# Altium schematic sheet MCU_ESP32.SchDoc: Projet M1 2024
size A4; DrawnBy: Group 04; DocumentNumber: 1; Revision: V1.0 Rev A; SheetNumber: 6; SheetTotal: 6
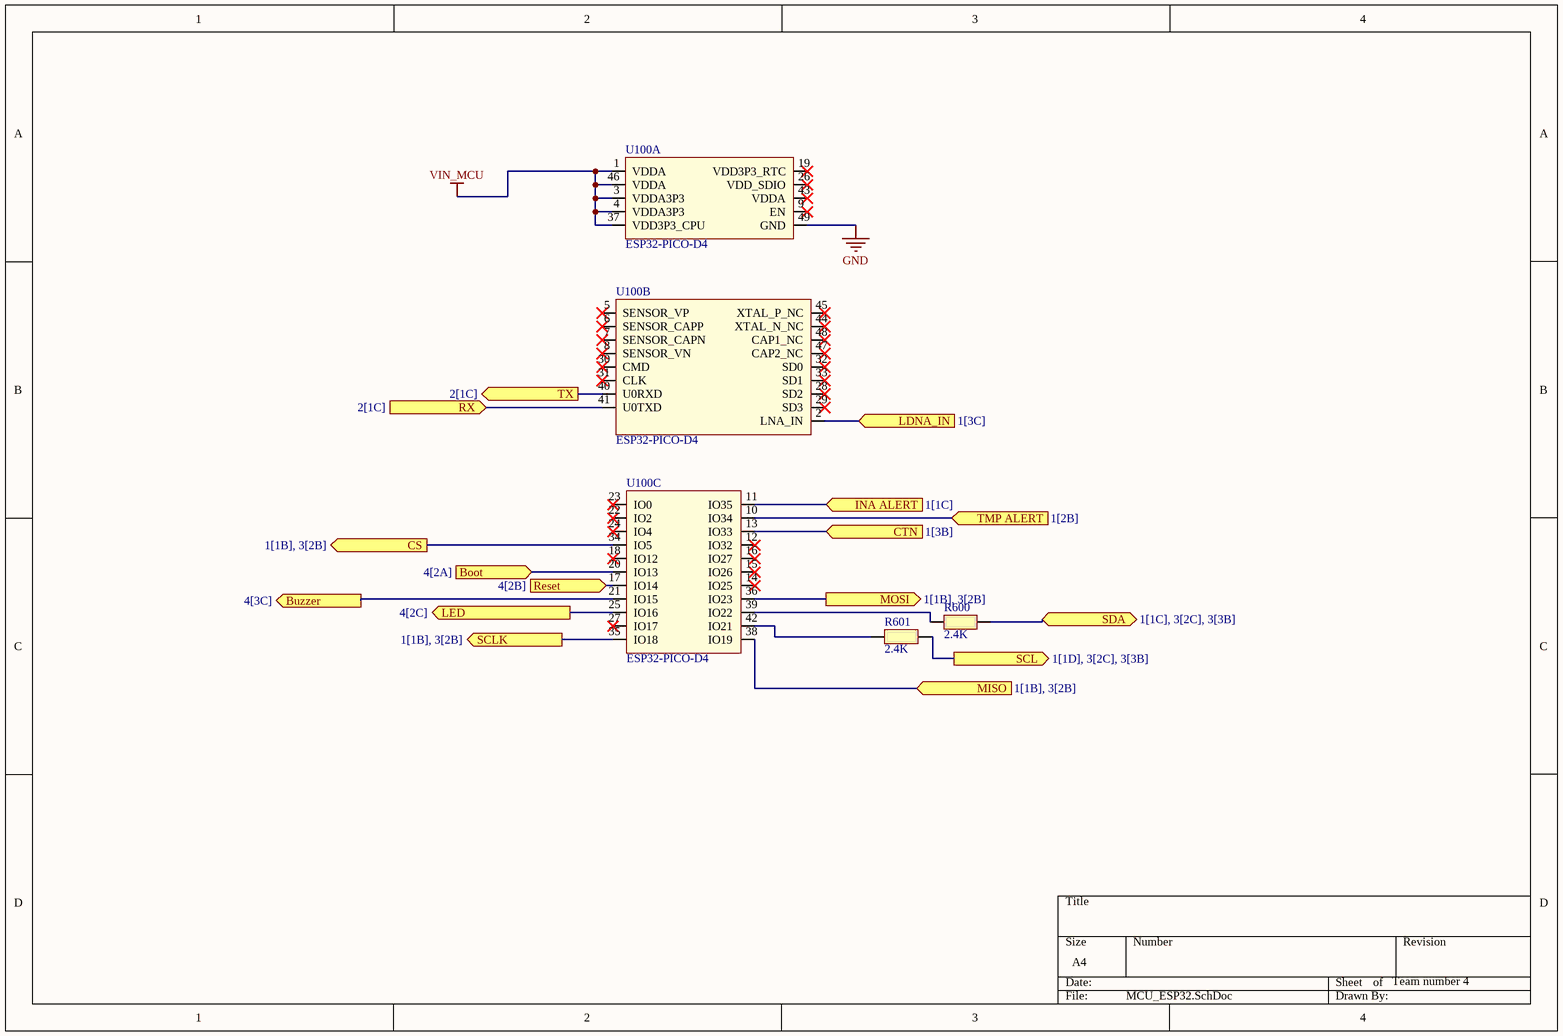
[diagram p0: MCU_ESP32.SchDoc]

## Parts
R600  2.4K  [RESC1005X06N]
R601  2.4K  [RESC1005X06N]
U100  ESP32-PICO-D4  [PQFN50P700X700X104_HS-49N]  (parts A,B,C of 3)

## Ports
Boot (in, see 4[2A]), Buzzer (out, see 4[3C]), CS (out, see 1[1B], 3[2B]), CTN (in, see 1[3B]), INA ALERT (in, see 1[1C]), LDNA_IN (in, see 1[3C]), LED (out, see 4[2C]), MISO (in, see 1[1B], 3[2B]), MOSI (out, see 1[1B], 3[2B]), Reset (in, see 4[2B]), RX (in, see 2[1C]), SCL (out, see 1[1D], 3[2C], 3[3B]), SCLK (out, see 1[1B], 3[2B]), SDA (bidir, see 1[1C], 3[2C], 3[3B]), TMP ALERT (in, see 1[2B]), TX (out, see 2[1C])

## Nets
GND: U100.49(GND)
VIN_MCU: U100.1(VDDA) U100.3(VDDA3P3) U100.4(VDDA3P3) U100.37(VDD3P3_CPU) U100.46(VDDA)
Boot: U100.20(IO13) ; port Boot
Buzzer: U100.21(IO15) ; port Buzzer
CS: U100.34(IO5) ; port CS
CTN: U100.13(IO33) ; port CTN
INA ALERT: U100.11(IO35) ; port INA ALERT
LDNA_IN: U100.2(LNA_IN) ; port LDNA_IN
LED: U100.25(IO16) ; port LED
MISO: U100.38(IO19) ; port MISO
MOSI: U100.36(IO23) ; port MOSI
Reset: U100.17(IO14) ; port Reset
RX: U100.41(U0TXD) ; port RX
SCL: R601.2 ; port SCL
SCLK: U100.35(IO18) ; port SCLK
SDA: R600.2 ; port SDA
TMP ALERT: U100.10(IO34) ; port TMP ALERT
TX: U100.40(U0RXD) ; port TX
NetR600_1: R600.1 U100.39(IO22)
NetR601_1: R601.1 U100.42(IO21)

Not connected (* = marked no-connect by the designer): U100 5(SENSOR_VP)* 6(SENSOR_CAPP)* 7(SENSOR_CAPN)* 8(SENSOR_VN)* 9(EN)* 12(IO32)* 14(IO25)* 15(IO26)* 16(IO27)* 18(IO12)* 19(VDD3P3_RTC)* 22(IO2)* 23(IO0)* 24(IO4)* 26(VDD_SDIO)* 27(IO17)* 28(SD2)* 29(SD3)* 30(CMD)* 31(CLK)* 32(SD0)* 33(SD1)* 43(VDDA)* 44(XTAL_N_NC)* 45(XTAL_P_NC)* 47(CAP2_NC)* 48(CAP1_NC)*

## Notes on the sheet
- Team number 4

## Library data of the parts
R600 R601 = Resistor
U100 = ESP32: Système RF sur puce - SoC SIP module ESP32 with 4MByte Flash, Dual Core MCU, Wi-Fi & Bluetooth Combo, LGA48-pin, 7*7mm; Manufacturer 1: Espressif Systems; Supplier 1: Digi-Key; Supplier Part Number 1: 1904-1029-1-ND; Manufacturer Part Number 1: ESP32-PICO-D4